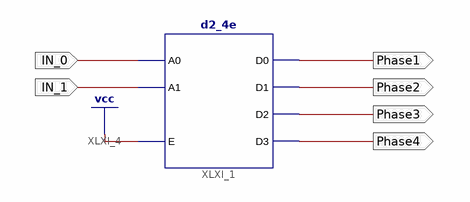
[diagram p0: schematic sheet 1]
// Xilinx ISE schematic Decoder_FullStep_OnePhase.sch (spartan6) as structural Verilog: 1 symbols, 6 ports
module Decoder_FullStep_OnePhase (
  input  IN_0,
  input  IN_1,
  output Phase1,
  output Phase2,
  output Phase3,
  output Phase4
);

  d2_4e XLXI_1 (.A0(IN_0), .A1(IN_1), .E(1'b1), .D0(Phase1), .D1(Phase2), .D2(Phase3), .D3(Phase4));
endmodule
